# Altium project BLDC_MOTOR_Driver_stm32f446re.PrjPcb (part 2 of 2)

## Sheet ADC_Input_protection.SchDoc
size A4; SheetNumber: 9; SheetTotal: 10
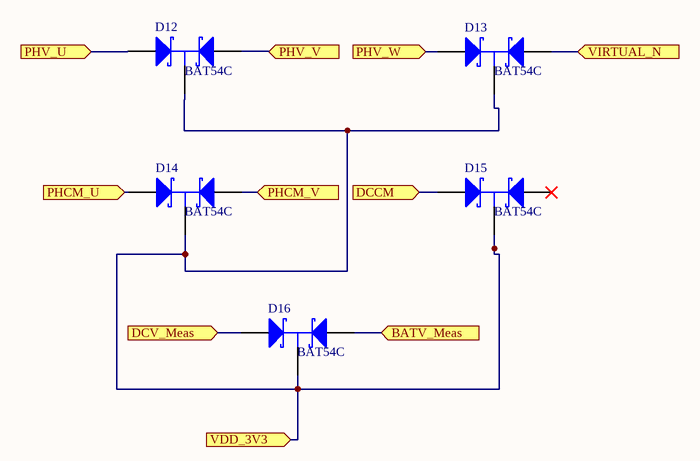
[diagram p5: ADC_Input_protection.SchDoc]

### Parts
D12  BAT54C  [NXP-SOT23-3_V]
D13  BAT54C  [NXP-SOT23-3_V]
D14  BAT54C  [NXP-SOT23-3_V]
D15  BAT54C  [NXP-SOT23-3_V]
D16  BAT54C  [NXP-SOT23-3_V]

### Ports
BATV_Meas (in, see DC_Current_Voltage_Measurement[2C], MCU[3C]), DCCM (in, see DC_Current_Voltage_Measurement[3A], MCU[3B]), DCV_Meas (in, see DC_Current_Voltage_Measurement[3D], MCU[3C]), PHCM_U (in, see MCU[3B], MotorDrivers[1C]), PHCM_V (in, see MCU[3B], MotorDrivers[1C]), PHV_U (in, see MCU[3C], PhaseVoltage[1A], ZeroCrossing[2B]), PHV_V (in, see MCU[3B], PhaseVoltage[1A], ZeroCrossing[2B]), PHV_W (in, see MCU[3C], PhaseVoltage[2A], ZeroCrossing[2C]), VDD_3V3 (in, see DC-DC_Buck_Converter+12Vto+3.3V[3C], DC_Current_Voltage_Measurement[3B], MCU[1B], MotorDrivers[1A], MotorDrivers[1B], Power[2C], ZeroCrossing[1A]), VIRTUAL_N (in, see MCU[3C], PhaseVoltage[1A], ZeroCrossing[1B])

### Nets
R_SHUNT1_N: D13.1(A) ; port VIRTUAL_N
NetC11_1: D12.3(K) D13.3(K) D14.3(K) D15.3(K) D16.3(K) ; port VDD_3V3
NetC41_1: D14.2(A) ; port PHCM_U
NetC42_1: D14.1(A) ; port PHCM_V
NetC45_2: D12.2(A) ; port PHV_U
NetC47_2: D12.1(A) ; port PHV_V
NetC49_2: D13.2(A) ; port PHV_W
NetC51_2: D15.2(A) ; port DCCM
NetC53_2: D16.1(A) ; port BATV_Meas
NetC54_2: D16.2(A) ; port DCV_Meas

Not connected (* = marked no-connect by the designer): D15 1(A)*

### Library data of the parts
D12-D16 = CMP-0417-00003-1: Schottky Barrier Diode, 30 V, 2 uA, -55 to 150 degC, 3-Pin SOT23, RoHS, Tape and Reel; Manufacturer: NXP Semiconductors; IR (uA): 2; VF (mV): 800; Trr (ns): 5; Cd (pF): 10; VR (V): 30; Rth(j-a) (K/W): 500; RoHS: TRUE; Packing: Tape and Reel; ComponentLink2URL: http://www.nxp.com/documents/data_sheet/BAT54_SER.pdf; PartNumber: BAT54C; ComponentLink2Description: Datasheet; Temperature Range: -55 to 150 degC; PackageReference: SOT23-3; PackageDescription: 3-Pin Plastic Surface-mounted Package, Body 1.3 x 2.9 mm, Pitch 0.95 mm; Mounting Technology: Surface Mount; ComponentLink1URL: http://www.nxp.com/; DatasheetVersion: Rev. 5; ComponentLink1Description: Manufacturer URL

## Sheet MotorDrivers.SchDoc
size A4; SheetNumber: 5; SheetTotal: 10
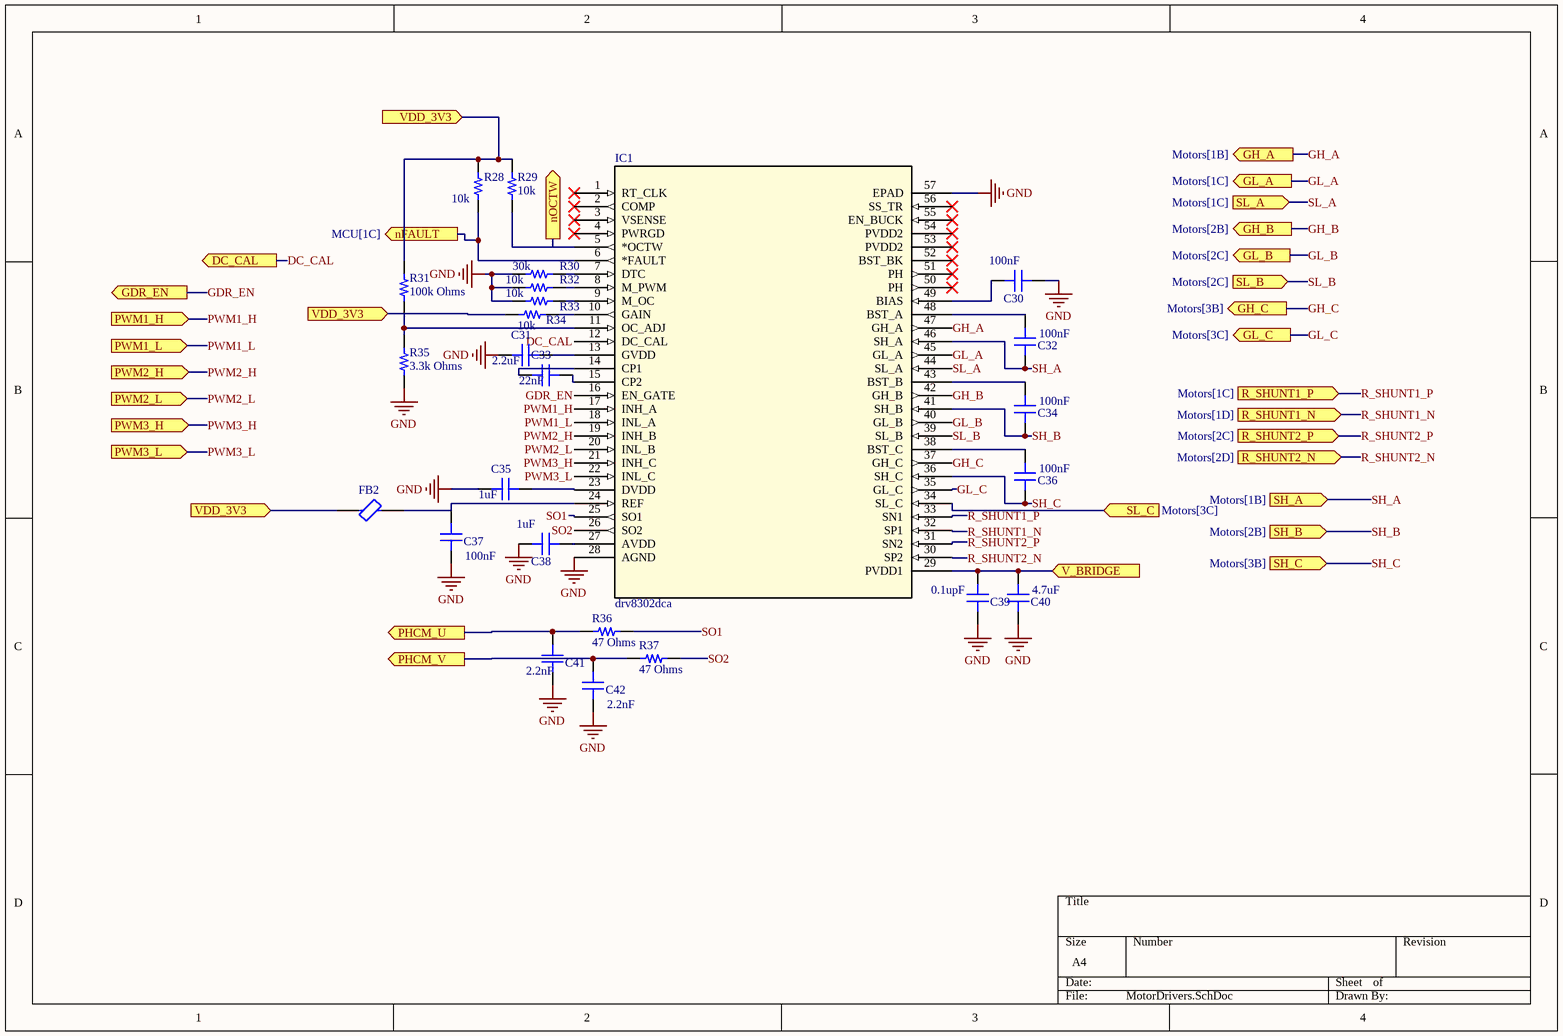
[diagram p6: MotorDrivers.SchDoc]

### Parts
C30  100nF  [CAP 0603_1608]
C31  2.2uF  [CAP 0603_1608]
C32  100nF  [CAP 0603_1608]
C33  22nF  [CAP 0603_1608]
C34  100nF  [CAP 0603_1608]
C35  1uF  [CAP 0603_1608]
C36  100nF  [CAP 0603_1608]
C37  100nF  [CAP 0603_1608]
C38  1uF  [CAP 0603_1608]
C39  0.1upF  [CAP 0603_1608]
C40  4.7uF  [CAP 0603_1608]
C41  2.2nF  [CAP 0603_1608]
C42  2.2nF  [CAP 0603_1608]
FB2  MPZ2012S601AT000  [FP-MPZ2012-MFG]  (value not drawn)
IC1  drv8302dca  [drv8302dca]
R28  10k  [RES 0402_1005]
R29  10k  [RES 0402_1005]
R30  30k  [RES 0402_1005]
R31  100k Ohms  [RES 0402_1005]
R32  10k  [RES 0402_1005]
R33  10k  [RES 0402_1005]
R34  10k  [RES 0402_1005]
R35  3.3k Ohms  [RES 0402_1005]
R36  47 Ohms  [RES 0402_1005]
R37  47 Ohms  [RES 0402_1005]

### Ports
DC_CAL (out, see MCU[3B]), GDR_EN (out, see MCU[3B], Power[2D]), GH_A (out, see Motors[1B]), GH_B (out, see Motors[2B]), GH_C (out, see Motors[3B]), GL_A (out, see Motors[1C]), GL_B (out, see Motors[2C]), GL_C (out, see Motors[3C]), nFAULT (out, see MCU[1C]), nOCTW (out, see MCU[1C]), PHCM_U (out, see ADC_Input_protection[2B], MCU[3B]), PHCM_V (out, see ADC_Input_protection[3B], MCU[3B]), PWM1_H (in, see MCU[3B]), PWM1_L (in, see MCU[3C]), PWM2_H (in, see MCU[3B]), PWM2_L (in, see MCU[3C]), PWM3_H (in, see MCU[3B]), PWM3_L (in, see MCU[3D]), R_SHUNT1_N (in, see Motors[1D]), R_SHUNT1_P (in, see Motors[1C]), R_SHUNT2_N (in, see Motors[2D]), R_SHUNT2_P (in, see Motors[2C]), SH_A (in, see Motors[1B]), SH_B (in, see Motors[2B]), SH_C (in, see Motors[3B]), SL_A (in, see Motors[1C]), SL_B (in, see Motors[2C]), SL_C (in, see Motors[3C]), V_BRIDGE (in, see DC-DC_Buck_Converter+12Vto+3.3V[1A], DC_Current_Voltage_Measurement[3B], Motors[1A], Power[4A]), VDD_3V3 (in, see ADC_Input_protection[3C], DC-DC_Buck_Converter+12Vto+3.3V[3C], DC_Current_Voltage_Measurement[3B], MCU[1B], MotorDrivers[1A], MotorDrivers[1B], Power[2C], ZeroCrossing[1A]), VDD_3V3 (in, see ADC_Input_protection[3C], DC-DC_Buck_Converter+12Vto+3.3V[3C], DC_Current_Voltage_Measurement[3B], MCU[1B], MotorDrivers[1B], Power[2C], ZeroCrossing[1A])

### Nets
R_SHUNT1_N: C30.2 C31.1 C35.1 C37.2 C38.2 C39.1 C40.1 C41.2 C42.2 IC1.28(AGND) IC1.30(SP2) IC1.32(SP1) IC1.34(SL_C) IC1.57(EPAD) R30.1 R32.1 R33.1 R35.2 ; port SL_C, port R_SHUNT1_N, port R_SHUNT2_N  [also labelled GND, R_SHUNT2_N]
DC_CAL: IC1.12(DC_CAL) ; port DC_CAL
GDR_EN: IC1.16(EN_GATE) ; port GDR_EN
GH_A: IC1.47(GH_A) ; port GH_A
GH_B: IC1.42(GH_B) ; port GH_B
GH_C: IC1.37(GH_C) ; port GH_C
GL_A: IC1.45(GL_A) ; port GL_A
GL_B: IC1.40(GL_B) ; port GL_B
GL_C: IC1.35(GL_C) ; port GL_C
PWM1_H: IC1.17(INH_A) ; port PWM1_H
PWM1_L: IC1.18(INL_A) ; port PWM1_L
PWM2_H: IC1.19(INH_B) ; port PWM2_H
PWM2_L: IC1.20(INL_B) ; port PWM2_L
PWM3_H: IC1.21(INH_C) ; port PWM3_H
PWM3_L: IC1.22(INL_C) ; port PWM3_L
R_SHUNT1_P: IC1.33(SN1) IC1.44(SL_A) ; port SL_A, port R_SHUNT1_P  [also labelled SL_A]
R_SHUNT2_P: IC1.31(SN2) IC1.39(SL_B) ; port SL_B, port R_SHUNT2_P  [also labelled SL_B]
SH_A: C32.1 IC1.46(SH_A) ; port SH_A  [project net MOTOR_U]
SH_B: C34.1 IC1.41(SH_B) ; port SH_B  [project net MOTOR_V]
SH_C: C36.1 IC1.36(SH_C) ; port SH_C  [project net MOTOR_W]
SO1: IC1.25(SO1) R36.2
SO2: IC1.26(SO2) R37.2
NetC2_1: C39.2 C40.2 IC1.29(PVDD1) ; port V_BRIDGE
NetC11_1: FB2.1 R28.1 R29.1 R31.1 R34.1 ; port VDD_3V3
NetC30_1: C30.1 IC1.49(BIAS)
NetC31_2: C31.2 IC1.13(GVDD)
NetC32_2: C32.2 IC1.48(BST_A)
NetC33_1: C33.1 IC1.14(CP1)
NetC33_2: C33.2 IC1.15(CP2)
NetC34_2: C34.2 IC1.43(BST_B)
NetC35_2: C35.2 IC1.23(DVDD)
NetC36_2: C36.2 IC1.38(BST_C)
NetC37_1: C37.1 FB2.2 IC1.24(REF)
NetC38_1: C38.1 IC1.27(AVDD)
NetC41_1: C41.1 R36.1 ; port PHCM_U
NetC42_1: C42.1 R37.1 ; port PHCM_V
NetIC1_5: IC1.5(*OCTW) R29.2 ; port nOCTW
NetIC1_6: IC1.6(*FAULT) R28.2 ; port nFAULT
NetIC1_7: IC1.7(DTC) R30.2
NetIC1_8: IC1.8(M_PWM) R32.2
NetIC1_9: IC1.9(M_OC) R33.2
NetIC1_10: IC1.10(GAIN) R34.2
NetIC1_11: IC1.11(OC_ADJ) R31.2 R35.1

Not connected (* = marked no-connect by the designer): IC1 1(RT_CLK)* 2(COMP)* 3(VSENSE)* 4(PWRGD)* 50(PH)* 51(PH)* 52(BST_BK)* 53(PVDD2)* 54(PVDD2)* 55(EN_BUCK)* 56(SS_TR)*

### Library data of the parts
C30 C32 C34 C36-C38 C40-C42 = 0603ZC102KAT2A: CAP CER 1000PF 10V X7R 0603; manufacturer: AVX Corporation; Tolerance: ±10%; Part Number: 0603ZC102KAT2A; Applications: General Purpose; componentlink1description: Datasheet; componentlink1url: http://datasheets.avx.com/X7RDielectric.pdf; componentlink2description: DigiKey Link; componentlink2url: http://digikey.com/product-detail/en/avx-corporation/0603ZC102KAT2A/478-0603ZC102KAT2ACT-ND/11570315; Device Package: 0603 (1608 Metric); lastupdated: 2.09.2020 01:02:55; Lifecycle Status: Active; Minimum Order: 1; Mounting Type: Surface Mount, MLCC; Operating Temperature: -55°C ~ 125°C; Package / Case: 0603 (1608 Metric); packaging: TapeAndReel; partid: 27370; Part Status: Active; price: 0.01; series: -; Supplier 1: DigiKey; Supplier Part Number 1: 478-0603ZC102KAT2ACT-ND; Temperature Coefficient: X7R; Voltage - Rated: 10V
  C30 C32 C34 C36 C37: Value: 100nF; Capacitance: 100nF
  C38: Value: 1uF; Capacitance: 1uF
  C40: Value: 4.7uF; Capacitance: 4.7uF
  C41 C42: Value: 2.2nF; Capacitance: 2.2nF
C31 C33 C35 = 0603ZC102KAT2A: CAP CER 1000PF 10V X7R 0603; manufacturer: AVX Corporation; Capacitance: 2.2nF; Tolerance: ±10%; Part Number: 0603ZC102KAT2A; Applications: General Purpose; componentlink1description: Datasheet; componentlink1url: http://datasheets.avx.com/X7RDielectric.pdf; componentlink2description: DigiKey Link; componentlink2url: http://digikey.com/product-detail/en/avx-corporation/0603ZC102KAT2A/478-0603ZC102KAT2ACT-ND/11570315; Device Package: 0603 (1608 Metric); lastupdated: 2.09.2020 01:02:55; Lifecycle Status: Active; Minimum Order: 1; Mounting Type: Surface Mount, MLCC; Operating Temperature: -55°C ~ 125°C; Package / Case: 0603 (1608 Metric); packaging: TapeAndReel; partid: 27370; Part Status: Active; price: 0.01; series: -; Supplier 1: DigiKey; Supplier Part Number 1: 478-0603ZC102KAT2ACT-ND; Temperature Coefficient: X7R; Voltage - Rated: 10V
  C31: Value: 2.2uF
  C33: Value: 22nF
  C35: Value: 1uF
C39 = 0603ZC102KAT2A: CAP CER 1000PF 10V X7R 0603; manufacturer: AVX Corporation; Capacitance: 0.1uF; Tolerance: ±10%; Part Number: 0603ZC102KAT2A; Value: 0.1upF; Applications: General Purpose; componentlink1description: Datasheet; componentlink1url: http://datasheets.avx.com/X7RDielectric.pdf; componentlink2description: DigiKey Link; componentlink2url: http://digikey.com/product-detail/en/avx-corporation/0603ZC102KAT2A/478-0603ZC102KAT2ACT-ND/11570315; Device Package: 0603 (1608 Metric); lastupdated: 2.09.2020 01:02:55; Lifecycle Status: Active; Minimum Order: 1; Mounting Type: Surface Mount, MLCC; Operating Temperature: -55°C ~ 125°C; Package / Case: 0603 (1608 Metric); packaging: TapeAndReel; partid: 27370; Part Status: Active; price: 0.01; series: -; Supplier 1: DigiKey; Supplier Part Number 1: 478-0603ZC102KAT2ACT-ND; Temperature Coefficient: X7R; Voltage - Rated: 10V
FB2 = CMP-2000-05401-2: Manufacturer Lifecycle Status: PRODUCTION; NexarPartId: 12090955; RMS Current (Irms): 2A; Test Frequency: 100MHz; Tolerance: 25%; Core Material: Ferrite; Series Resistance: 100mΩ; Impedance: 600Ω; Packaging: Digi-Reel®; Length: 2mm; Min Operating Temperature: -55°C; Width: 1.25mm; Max Width: 1.45mm; Lead Free: Lead Free; Current Rating: 2A; Case Code (Imperial): 0805; Min Length: 1.8mm; Schedule B: 8504500000, 8504500000; REACH SVHC: No SVHC; Case Code (Metric): 2012; Max DC Current: 2A; Case/Package: 0805; Lifecycle Status: Production; Min Width: 1.05mm; Mount: Surface Mount; Height: 1.0414mm; Resistance: 100mΩ; DC Resistance (DCR): 100mΩ; Max Operating Temperature: 125°C; Max Length: 2.2mm; RoHS: Compliant
R28 R29 R32-R34 = ESR01MZPF47R0: ANTI-SURGE CHIP RESISTORS; Manufacturer: Rohm Semiconductor; Power (Watts): 0.2W, 1/5W; Resistance: 10k Ohms; Temperature Coefficient: ±100ppm/°C; Tolerance: ±1%; Part Number: ESR01MZPF47R0; Value: 10k; ComponentLink1Description: Datasheet; ComponentLink1URL: https://fscdn.rohm.com/en/products/databook/datasheet/passive/resistor/chip_resistor/esr-e.pdf; ComponentLink2Description: DigiKey Link; ComponentLink2URL: https://www.digikey.com/en/products/detail/rohm-semiconductor/ESR01MZPF47R0/16180187; Composition: Thick Film; Device Package: 0402 (1005 Metric); Features: Automotive AEC-Q200, Pulse Withstanding; Height - Seated (Max): 0.016" (0.40mm); LastUpdated: 5.10.2023 19:23:22; Lifecycle Status: Active; Minimum Order: 1; Number of Terminations: 2; Operating Temperature: -55°C ~ 155°C; Package / Case: 0402 (1005 Metric); Packaging: TapeAndReel; PartId: 67421; Part Status: Active; Price: 0.03; Ratings: AEC-Q200; Series: ESR; Size / Dimension: 0.039" L x 0.020" W (1.00mm x 0.50mm); Supplier 1: DigiKey; Supplier Part Number 1: 511-ESR01MZPF47R0CT-ND; Supplier Device Package: 0402
R30 = ESR01MZPF47R0: ANTI-SURGE CHIP RESISTORS; Manufacturer: Rohm Semiconductor; Power (Watts): 0.2W, 1/5W; Resistance: 30k Ohms; Temperature Coefficient: ±100ppm/°C; Tolerance: ±1%; Part Number: ESR01MZPF47R0; Value: 30k; ComponentLink1Description: Datasheet; ComponentLink1URL: https://fscdn.rohm.com/en/products/databook/datasheet/passive/resistor/chip_resistor/esr-e.pdf; ComponentLink2Description: DigiKey Link; ComponentLink2URL: https://www.digikey.com/en/products/detail/rohm-semiconductor/ESR01MZPF47R0/16180187; Composition: Thick Film; Device Package: 0402 (1005 Metric); Features: Automotive AEC-Q200, Pulse Withstanding; Height - Seated (Max): 0.016" (0.40mm); LastUpdated: 5.10.2023 19:23:22; Lifecycle Status: Active; Minimum Order: 1; Number of Terminations: 2; Operating Temperature: -55°C ~ 155°C; Package / Case: 0402 (1005 Metric); Packaging: TapeAndReel; PartId: 67421; Part Status: Active; Price: 0.03; Ratings: AEC-Q200; Series: ESR; Size / Dimension: 0.039" L x 0.020" W (1.00mm x 0.50mm); Supplier 1: DigiKey; Supplier Part Number 1: 511-ESR01MZPF47R0CT-ND; Supplier Device Package: 0402
R31 R35 = ESR01MZPF47R0: ANTI-SURGE CHIP RESISTORS; Manufacturer: Rohm Semiconductor; Power (Watts): 0.2W, 1/5W; Resistance: 47 Ohms; Temperature Coefficient: ±100ppm/°C; Tolerance: ±1%; Part Number: ESR01MZPF47R0; ComponentLink1Description: Datasheet; ComponentLink1URL: https://fscdn.rohm.com/en/products/databook/datasheet/passive/resistor/chip_resistor/esr-e.pdf; ComponentLink2Description: DigiKey Link; ComponentLink2URL: https://www.digikey.com/en/products/detail/rohm-semiconductor/ESR01MZPF47R0/16180187; Composition: Thick Film; Device Package: 0402 (1005 Metric); Features: Automotive AEC-Q200, Pulse Withstanding; Height - Seated (Max): 0.016" (0.40mm); LastUpdated: 5.10.2023 19:23:22; Lifecycle Status: Active; Minimum Order: 1; Number of Terminations: 2; Operating Temperature: -55°C ~ 155°C; Package / Case: 0402 (1005 Metric); Packaging: TapeAndReel; PartId: 67421; Part Status: Active; Price: 0.03; Ratings: AEC-Q200; Series: ESR; Size / Dimension: 0.039" L x 0.020" W (1.00mm x 0.50mm); Supplier 1: DigiKey; Supplier Part Number 1: 511-ESR01MZPF47R0CT-ND; Supplier Device Package: 0402
  R31: Value: 100k Ohms
  R35: Value: 3.3k Ohms
R36 R37 = ESR01MZPF47R0: ANTI-SURGE CHIP RESISTORS; Manufacturer: Rohm Semiconductor; Power (Watts): 0.2W, 1/5W; Temperature Coefficient: ±100ppm/°C; Tolerance: ±1%; Part Number: ESR01MZPF47R0; Value: 47 Ohms; ComponentLink1Description: Datasheet; ComponentLink1URL: https://fscdn.rohm.com/en/products/databook/datasheet/passive/resistor/chip_resistor/esr-e.pdf; ComponentLink2Description: DigiKey Link; ComponentLink2URL: https://www.digikey.com/en/products/detail/rohm-semiconductor/ESR01MZPF47R0/16180187; Composition: Thick Film; Device Package: 0402 (1005 Metric); Features: Automotive AEC-Q200, Pulse Withstanding; Height - Seated (Max): 0.016" (0.40mm); LastUpdated: 5.10.2023 19:23:22; Lifecycle Status: Active; Minimum Order: 1; Number of Terminations: 2; Operating Temperature: -55°C ~ 155°C; Package / Case: 0402 (1005 Metric); Packaging: TapeAndReel; PartId: 67421; Part Status: Active; Price: 0.03; Ratings: AEC-Q200; Resistance: 47 Ohms; Series: ESR; Size / Dimension: 0.039" L x 0.020" W (1.00mm x 0.50mm); Supplier 1: DigiKey; Supplier Part Number 1: 511-ESR01MZPF47R0CT-ND; Supplier Device Package: 0402

## Sheet ZeroCrossing.SchDoc
size A4; SheetNumber: 7; SheetTotal: 10
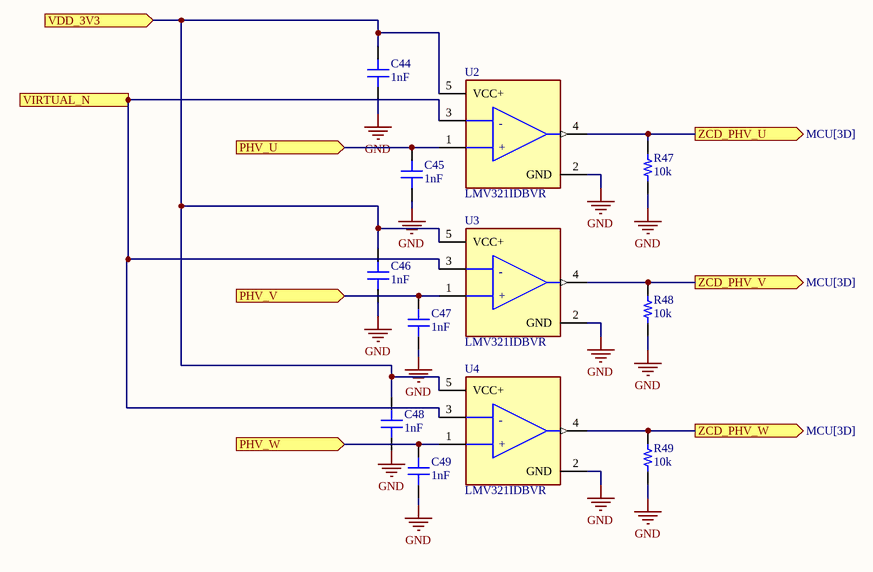
[diagram p7: ZeroCrossing.SchDoc]

### Parts
C44  1nF  [CAP 0603_1608]
C45  1nF  [CAP 0603_1608]
C46  1nF  [CAP 0603_1608]
C47  1nF  [CAP 0603_1608]
C48  1nF  [CAP 0603_1608]
C49  1nF  [CAP 0603_1608]
R47  10k  [RES 0402_1005]
R48  10k  [RES 0402_1005]
R49  10k  [RES 0402_1005]
U2  LMV321IDBVR  [FP-DBV0005A-MFG]
U3  LMV321IDBVR  [FP-DBV0005A-MFG]
U4  LMV321IDBVR  [FP-DBV0005A-MFG]

### Ports
PHV_U (in, see ADC_Input_protection[2B], MCU[3C], PhaseVoltage[1A]), PHV_V (in, see ADC_Input_protection[3B], MCU[3B], PhaseVoltage[1A]), PHV_W (in, see ADC_Input_protection[3B], MCU[3C], PhaseVoltage[2A]), VDD_3V3 (in, see ADC_Input_protection[3C], DC-DC_Buck_Converter+12Vto+3.3V[3C], DC_Current_Voltage_Measurement[3B], MCU[1B], MotorDrivers[1A], MotorDrivers[1B], Power[2D]), VIRTUAL_N (in, see ADC_Input_protection[4B], MCU[3C]), ZCD_PHV_U (out, see MCU[3D]), ZCD_PHV_V (out, see MCU[3D]), ZCD_PHV_W (out, see MCU[3D])

### Nets
GND: C44.1 C45.1 C46.1 C47.1 C48.1 C49.1 R47.1 R48.1 R49.1 U2.2(GND) U2.3(1IN-) U3.2(GND) U3.3(1IN-) U4.2(GND) U4.3(1IN-) ; port VIRTUAL_N  [project net R_SHUNT1_N]
NetC11_1: C44.2 C46.2 C48.2 U2.5(VCC+) U3.5(VCC+) U4.5(VCC+) ; port VDD_3V3
NetC45_2: C45.2 U2.1(1IN+) ; port PHV_U
NetC47_2: C47.2 U3.1(1IN+) ; port PHV_V
NetC49_2: C49.2 U4.1(1IN+) ; port PHV_W
NetIC2_24: R47.2 U2.4(OUT) ; port ZCD_PHV_U
NetIC2_37: R48.2 U3.4(OUT) ; port ZCD_PHV_V
NetIC2_51: R49.2 U4.4(OUT) ; port ZCD_PHV_W

### Notes on the sheet
- (in symbol CMP-04895-000056-1) -; +

### Library data of the parts
C44-C49 = 0603ZC102KAT2A: as C30 on sheet MotorDrivers; Part Number: 0603ZC102KAT2A; Value: 1nF; Applications: General Purpose; Capacitance: 1nF; componentlink1description: Datasheet; componentlink1url: http://datasheets.avx.com/X7RDielectric.pdf; componentlink2description: DigiKey Link; componentlink2url: http://digikey.com/product-detail/en/avx-corporation/0603ZC102KAT2A/478-0603ZC102KAT2ACT-ND/11570315; Device Package: 0603 (1608 Metric); lastupdated: 2.09.2020 01:02:55; Lifecycle Status: Active; Minimum Order: 1; Mounting Type: Surface Mount, MLCC; Operating Temperature: -55°C ~ 125°C; Package / Case: 0603 (1608 Metric); packaging: TapeAndReel; partid: 27370; Part Status: Active; price: 0.01; series: -; Supplier 1: DigiKey; Supplier Part Number 1: 478-0603ZC102KAT2ACT-ND; Temperature Coefficient: X7R; Voltage - Rated: 10V
R47-R49 = ESR01MZPF47R0: as R28 on sheet MotorDrivers; Part Number: ESR01MZPF47R0; Value: 10k; ComponentLink1Description: Datasheet; ComponentLink1URL: https://fscdn.rohm.com/en/products/databook/datasheet/passive/resistor/chip_resistor/esr-e.pdf; ComponentLink2Description: DigiKey Link; ComponentLink2URL: https://www.digikey.com/en/products/detail/rohm-semiconductor/ESR01MZPF47R0/16180187; Composition: Thick Film; Device Package: 0402 (1005 Metric); Features: Automotive AEC-Q200, Pulse Withstanding; Height - Seated (Max): 0.016" (0.40mm); LastUpdated: 5.10.2023 19:23:22; Lifecycle Status: Active; Minimum Order: 1; Number of Terminations: 2; Operating Temperature: -55°C ~ 155°C; Package / Case: 0402 (1005 Metric); Packaging: TapeAndReel; PartId: 67421; Part Status: Active; Price: 0.03; Ratings: AEC-Q200; Series: ESR; Size / Dimension: 0.039" L x 0.020" W (1.00mm x 0.50mm); Supplier 1: DigiKey; Supplier Part Number 1: 511-ESR01MZPF47R0CT-ND; Supplier Device Package: 0402
U2-U4 = CMP-04895-000056-1: IC OPAMP GP 1 CIRCUIT SOT23-5; Manufacturer: Texas Instruments; Bandwidth: 1MHz; Number Of Channels: 1; Max Junction Temp: +150°C; Input Offset Voltage: 1.7mV; Standoff Height: 0mm; Voltage Gain: 100V/mV; Min Supply Voltage: 2.7V; Input Bias Current: 0.015uA; Nominal Supply Current: 80-130uA; Max Supply Voltage: 5.5V; Ambient Temperature Range Low: -40°C; Device Class L3: Amplifiers - Op Amps; Package: DBV0005A; Temperature: -40°C to +125°C; Automotive: No; Ambient Temperature Range High: +125°C; ComponentLink2Description: Datasheet; Manufacturer Part Number: LMV321IDBVR; Octopart: https://octopart.com/lmv321idbvr-texas+instruments-410381; ComponentLink2URL: http://www.ti.com/lit/ds/symlink/lmv321.pdf; Temperature Range High: +125°C; Device Class L1: Integrated Circuits (ICs); Temperature Range Low: -40°C; Digikey Description: IC OPAMP GP 1 CIRCUIT SOT23-5; RoHS: TRUE; Height: 1.45mm; Mouser Description: Operational Amplifiers - Op Amps Low V R/R; Device Class L2: Linear ICs; Gain Bandwidth: 1MHz; Lead Free: Yes; Category: IC

## Sheet DC_Current_Voltage_Measurement.SchDoc
size A4; SheetNumber: 8; SheetTotal: 10
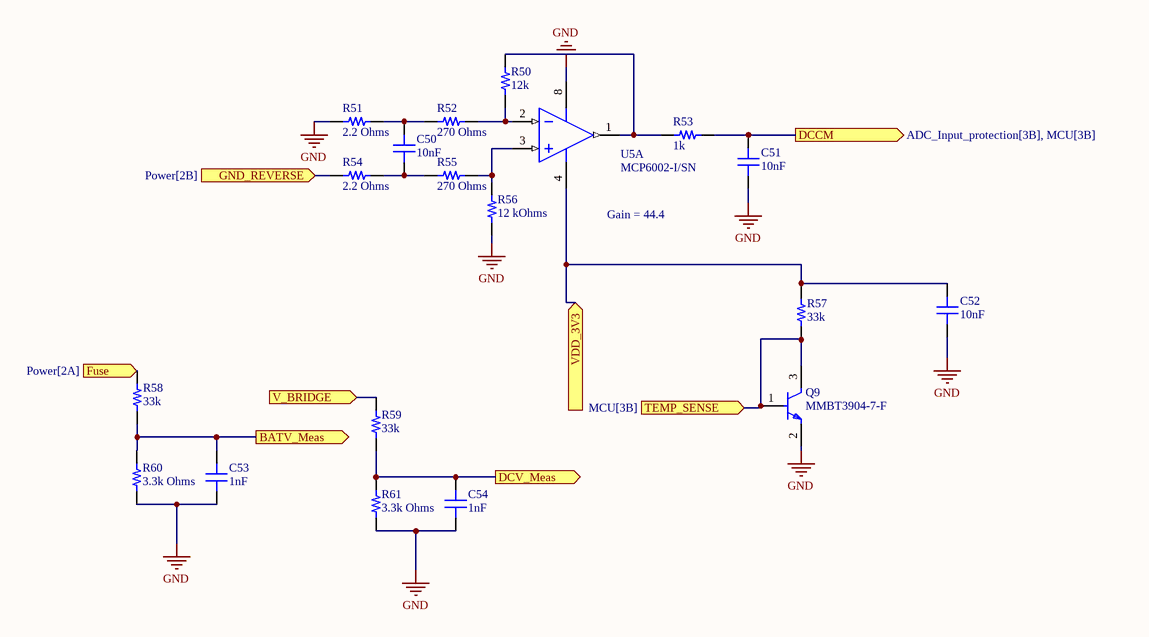
[diagram p8: DC_Current_Voltage_Measurement.SchDoc]

### Parts
C50  10nF  [CAP 0603_1608]
C51  10nF  [CAP 0603_1608]
C52  10nF  [CAP 0603_1608]
C53  1nF  [CAP 0603_1608]
C54  1nF  [CAP 0603_1608]
Q9  MMBT3904-7-F  [FP-SOT23-IPC_A]
R50  12k  [RES 0402_1005]
R51  2.2 Ohms  [RES 0402_1005]
R52  270 Ohms  [RES 0402_1005]
R53  1k  [RES 0402_1005]
R54  2.2 Ohms  [RES 0402_1005]
R55  270 Ohms  [RES 0402_1005]
R56  12 kOhms  [RES 0402_1005]
R57  33k  [RES 0402_1005]
R58  33k  [RES 0402_1005]
R59  33k  [RES 0402_1005]
R60  3.3k Ohms  [RES 0402_1005]
R61  3.3k Ohms  [RES 0402_1005]
U5  MCP6002-I/SN  [SOIC-SN8_M]  (part A of 2)

### Ports
BATV_Meas (out, see ADC_Input_protection[3C], MCU[3C]), DCCM (out, see ADC_Input_protection[3B], MCU[3B]), DCV_Meas (out, see ADC_Input_protection[2C], MCU[3C]), Fuse (in, see Power[2A]), GND_REVERSE (in, see Power[2B]), TEMP_SENSE (in, see MCU[3B]), V_BRIDGE (in, see DC-DC_Buck_Converter+12Vto+3.3V[1A], MotorDrivers[3C], Motors[1A], Power[4A]), VDD_3V3 (in, see ADC_Input_protection[3C], DC-DC_Buck_Converter+12Vto+3.3V[3C], MCU[1B], MotorDrivers[1A], MotorDrivers[1B], Power[2C], ZeroCrossing[1A])

### Nets
GND: C51.1 C52.1 C53.1 C54.1 Q9.2(E) R51.1 R54.1 R56.1 R60.1 R61.1 U5.8(VDD) ; port GND_REVERSE  [project net R_SHUNT1_N]
NetC1_1: R58.2 ; port Fuse
NetC2_1: R59.2 ; port V_BRIDGE
NetC11_1: C52.2 R57.2 U5.4(VSS) ; port VDD_3V3
NetC50_1: C50.1 R54.2 R55.1
NetC50_2: C50.2 R51.2 R52.1
NetC51_2: C51.2 R53.2 ; port DCCM
NetC53_2: C53.2 R58.1 R60.2 ; port BATV_Meas
NetC54_2: C54.2 R59.1 R61.2 ; port DCV_Meas
NetIC2_22: Q9.1(B) Q9.3(C) R57.1 ; port TEMP_SENSE
NetR50_1: R50.1 R52.2 U5.2(VINA-)
NetR50_2: R50.2 R53.1 U5.1(VOUTA)
NetR55_2: R55.2 R56.2 U5.3(VINA+)

### Notes on the sheet
- Gain = 44.4

### Library data of the parts
C50-C54 = 0603ZC102KAT2A: as C30 on sheet MotorDrivers; Part Number: 0603ZC102KAT2A; Applications: General Purpose; componentlink1description: Datasheet; componentlink1url: http://datasheets.avx.com/X7RDielectric.pdf; componentlink2description: DigiKey Link; componentlink2url: http://digikey.com/product-detail/en/avx-corporation/0603ZC102KAT2A/478-0603ZC102KAT2ACT-ND/11570315; Device Package: 0603 (1608 Metric); lastupdated: 2.09.2020 01:02:55; Lifecycle Status: Active; Minimum Order: 1; Mounting Type: Surface Mount, MLCC; Operating Temperature: -55°C ~ 125°C; Package / Case: 0603 (1608 Metric); packaging: TapeAndReel; partid: 27370; Part Status: Active; price: 0.01; series: -; Supplier 1: DigiKey; Supplier Part Number 1: 478-0603ZC102KAT2ACT-ND; Temperature Coefficient: X7R; Voltage - Rated: 10V
  C50-C52: Value: 10nF; Capacitance: 10nF
  C53 C54: Value: 1nF; Capacitance: 1nF
Q9 = CMP-2000-04931-2: TRANS NPN 40V 0.2A SMD SOT23-3; Frequency: 300MHz; Power Dissipation: 350mW; Element Configuration: Single; Max Power Dissipation: 300mW; Max Collector Current: 200mA; Collector Emitter Saturation Voltage: 300mV; Number of Elements: 1; hFE Min: 100; Collector Base Voltage (VCBO): 60V; Emitter Base Voltage (VEBO): 6V; Contact Plating: Tin; Package Quantity: 3000; Max Frequency: 300MHz; REACH SVHC: No SVHC; Max Operating Temperature: 150°C; Width: 1.4mm; Collector Emitter Voltage (VCEO): 40V; Voltage Rating (DC): 40V; Radiation Hardening: No; Case/Package: SOT-23; Height: 1mm; Collector Emitter Breakdown Voltage: 40V; Length: 3.05mm; Polarity: NPN; Packaging: Tape and Reel; Number of Pins: 3; Min Operating Temperature: -55°C; Gain Bandwidth Product: 300MHz; Mount: Surface Mount; Weight: 0.000282oz; Continuous Collector Current: 200mA; Transition Frequency: 300MHz; Max Breakdown Voltage: 40V; Lead Free: Lead Free
R50 = ESR01MZPF47R0: ANTI-SURGE CHIP RESISTORS; Manufacturer: Rohm Semiconductor; Power (Watts): 0.2W, 1/5W; Resistance: 12k Ohms; Temperature Coefficient: ±100ppm/°C; Tolerance: ±1%; Part Number: ESR01MZPF47R0; Value: 12k; ComponentLink1Description: Datasheet; ComponentLink1URL: https://fscdn.rohm.com/en/products/databook/datasheet/passive/resistor/chip_resistor/esr-e.pdf; ComponentLink2Description: DigiKey Link; ComponentLink2URL: https://www.digikey.com/en/products/detail/rohm-semiconductor/ESR01MZPF47R0/16180187; Composition: Thick Film; Device Package: 0402 (1005 Metric); Features: Automotive AEC-Q200, Pulse Withstanding; Height - Seated (Max): 0.016" (0.40mm); LastUpdated: 5.10.2023 19:23:22; Lifecycle Status: Active; Minimum Order: 1; Number of Terminations: 2; Operating Temperature: -55°C ~ 155°C; Package / Case: 0402 (1005 Metric); Packaging: TapeAndReel; PartId: 67421; Part Status: Active; Price: 0.03; Ratings: AEC-Q200; Series: ESR; Size / Dimension: 0.039" L x 0.020" W (1.00mm x 0.50mm); Supplier 1: DigiKey; Supplier Part Number 1: 511-ESR01MZPF47R0CT-ND; Supplier Device Package: 0402
R51 R54 R60 R61 = SG73P1EWTTP2R20F: RES 2.2 OHM 1% 1/4W 0402; Manufacturer: KOA Speer Electronics, Inc.; Power (Watts): 0.25W, 1/4W; Temperature Coefficient: ±200ppm/°C; Part Number: SG73P1EWTTP2R20F; ComponentLink1Description: Datasheet; ComponentLink1URL: https://www.koaspeer.com/pdfs/SG73P.pdf; ComponentLink2Description: DigiKey Link; ComponentLink2URL: https://www.digikey.com/en/products/detail/koa-speer-electronics-inc/SG73P1EWTTP2R20F/14316750; Composition: Thick Film; Device Package: 0402 (1005 Metric); Features: Automotive AEC-Q200, Pulse Withstanding; Height - Seated (Max): 0.016" (0.40mm); LastUpdated: 5.10.2023 19:23:22; Lifecycle Status: Active; Minimum Order: 1; Number of Terminations: 2; Operating Temperature: -55°C ~ 155°C; Package / Case: 0402 (1005 Metric); Packaging: TapeAndReel; PartId: 67136; Part Status: Active; Price: 0.01; Ratings: AEC-Q200; Series: SG73P; Size / Dimension: 0.039" L x 0.020" W (1.00mm x 0.50mm); Supplier 1: DigiKey; Supplier Part Number 1: 2019-SG73P1EWTTP2R20FCT-ND; Supplier Device Package: 0402; Tolerance: ±1%
  R51 R54: Value: 2.2 Ohms; Resistance: 2.2 Ohms
  R60 R61: Value: 3.3k Ohms; Resistance: 3.3k Ohms
R52 R55 = RK73H1ETTP2R70F: RES 2.7 OHM 1% 1/10W 0402; Manufacturer: KOA Speer Electronics, Inc.; Power (Watts): 0.1W, 1/10W; Temperature Coefficient: ±200ppm/°C; Part Number: RK73H1ETTP2R70F; Value: 270 Ohms; ComponentLink1Description: Datasheet; ComponentLink1URL: http://www.koaspeer.com/catimages/Products/RK73H/RK73H.pdf; ComponentLink2Description: DigiKey Link; ComponentLink2URL: https://www.digikey.com/en/products/detail/koa-speer-electronics-inc/RK73H1ETTP2R70F/9844612; Composition: Thick Film; Device Package: 0402 (1005 Metric); Features: Automotive AEC-Q200, Moisture Resistant; Height - Seated (Max): 0.016" (0.40mm); LastUpdated: 5.10.2023 19:24:09; Lifecycle Status: Active; Minimum Order: 1; Number of Terminations: 2; Operating Temperature: -55°C ~ 155°C; Package / Case: 0402 (1005 Metric); Packaging: CutTape; PartId: 14375; Part Status: Active; Price: 0.01; Ratings: AEC-Q200; Resistance: 270 Ohms; Series: RK73H; Size / Dimension: 0.039" L x 0.020" W (1.00mm x 0.50mm); Supplier 1: DigiKey; Supplier Part Number 1: 2019-RK73H1ETTP2R70FCT-ND; Supplier Device Package: 0402; Tolerance: ±1%
R53 = ESR01MZPF47R0: ANTI-SURGE CHIP RESISTORS; Manufacturer: Rohm Semiconductor; Power (Watts): 0.2W, 1/5W; Resistance: 1k Ohms; Temperature Coefficient: ±100ppm/°C; Tolerance: ±1%; Part Number: ESR01MZPF47R0; Value: 1k; ComponentLink1Description: Datasheet; ComponentLink1URL: https://fscdn.rohm.com/en/products/databook/datasheet/passive/resistor/chip_resistor/esr-e.pdf; ComponentLink2Description: DigiKey Link; ComponentLink2URL: https://www.digikey.com/en/products/detail/rohm-semiconductor/ESR01MZPF47R0/16180187; Composition: Thick Film; Device Package: 0402 (1005 Metric); Features: Automotive AEC-Q200, Pulse Withstanding; Height - Seated (Max): 0.016" (0.40mm); LastUpdated: 5.10.2023 19:23:22; Lifecycle Status: Active; Minimum Order: 1; Number of Terminations: 2; Operating Temperature: -55°C ~ 155°C; Package / Case: 0402 (1005 Metric); Packaging: TapeAndReel; PartId: 67421; Part Status: Active; Price: 0.03; Ratings: AEC-Q200; Series: ESR; Size / Dimension: 0.039" L x 0.020" W (1.00mm x 0.50mm); Supplier 1: DigiKey; Supplier Part Number 1: 511-ESR01MZPF47R0CT-ND; Supplier Device Package: 0402
R56 = CRGP0402F12K: RES 12K OHM 1% 1/8W 0402; Manufacturer: TE Connectivity Passive Product; Power (Watts): 0.125W, 1/8W; Temperature Coefficient: ±100ppm/°C; Part Number: CRGP0402F12K; Value: 12 kOhms; ComponentLink1Description: Datasheet; ComponentLink1URL: https://www.te.com/commerce/DocumentDelivery/DDEController?Action=srchrtrv&DocNm=9-1773463-9&DocType=DS&DocLang=English; ComponentLink2Description: DigiKey Link; ComponentLink2URL: https://www.digikey.com/en/products/detail/te-connectivity-passive-product/CRGP0402F12K/8576970; Composition: Thick Film; Device Package: 0402 (1005 Metric); Features: Pulse Withstanding; Height - Seated (Max): 0.016" (0.40mm); LastUpdated: 5.10.2023 19:23:42; Lifecycle Status: Active; Minimum Order: 1; Number of Terminations: 2; Operating Temperature: -55°C ~ 155°C; Package / Case: 0402 (1005 Metric); Packaging: TapeAndReel; PartId: 21536; Part Status: Active; Price: 0.01; Resistance: 12 kOhms; Series: CRGP; Size / Dimension: 0.043" L x 0.020" W (1.10mm x 0.50mm); Supplier 1: DigiKey; Supplier Part Number 1: A130368CT-ND; Supplier Device Package: 0402; Tolerance: ±1%
R57-R59 = SG73P1EWTTP2R20F: RES 2.2 OHM 1% 1/4W 0402; Manufacturer: KOA Speer Electronics, Inc.; Power (Watts): 0.25W, 1/4W; Resistance: 33k Ohms; Temperature Coefficient: ±200ppm/°C; Part Number: SG73P1EWTTP2R20F; Value: 33k; ComponentLink1Description: Datasheet; ComponentLink1URL: https://www.koaspeer.com/pdfs/SG73P.pdf; ComponentLink2Description: DigiKey Link; ComponentLink2URL: https://www.digikey.com/en/products/detail/koa-speer-electronics-inc/SG73P1EWTTP2R20F/14316750; Composition: Thick Film; Device Package: 0402 (1005 Metric); Features: Automotive AEC-Q200, Pulse Withstanding; Height - Seated (Max): 0.016" (0.40mm); LastUpdated: 5.10.2023 19:23:22; Lifecycle Status: Active; Minimum Order: 1; Number of Terminations: 2; Operating Temperature: -55°C ~ 155°C; Package / Case: 0402 (1005 Metric); Packaging: TapeAndReel; PartId: 67136; Part Status: Active; Price: 0.01; Ratings: AEC-Q200; Series: SG73P; Size / Dimension: 0.039" L x 0.020" W (1.00mm x 0.50mm); Supplier 1: DigiKey; Supplier Part Number 1: 2019-SG73P1EWTTP2R20FCT-ND; Supplier Device Package: 0402; Tolerance: ±1%
U5 = CMP-0187-00365-3: None; Bandwidth: 1MHz; Number of Elements: 2; Power Supply Rejection Ratio (PSRR): 86dB; Nominal Supply Current: 100uA; Max Supply Voltage: 6V; Input Offset Voltage-Max: 4.5mV; Voltage Gain: 112dB; Input Bias Current: 1pA; Min Supply Voltage: 1.8V; Slew Rate: 0.6V/µs; Operating Supply Voltage: 5.5V; Amplifier Type: GENERAL PURPOSE; Output Current: 23mA; Common Mode Rejection Ratio: 60dB; Gain Bandwidth Product: 1MHz; Min Operating Temperature: -40°C; Supply Current: 100uA; Number of Circuits: 2; Package Quantity: 100; Width: 3.9mm; Technology: CMOS; RoHS Compliant: Yes; Radiation Hardening: No; Mount: Surface Mount; Number of Pins: 8; Length: 4.9mm; Case/Package: SOIC; Number of Channels: 2; Max Operating Temperature: 85°C; Unity Gain Bandwidth Product: 1MHz; Lead Free: Lead Free; Number of Amplifiers: 2; REACH SVHC: No SVHC; Slew Rate-Nom: 0.6V/µs; Height: 1.25mm; Input Offset Voltage (Vos): 4.5mV; Packaging: Rail/Tube

## Sheet MCU.SchDoc
size A4; SheetNumber: 10; SheetTotal: 10
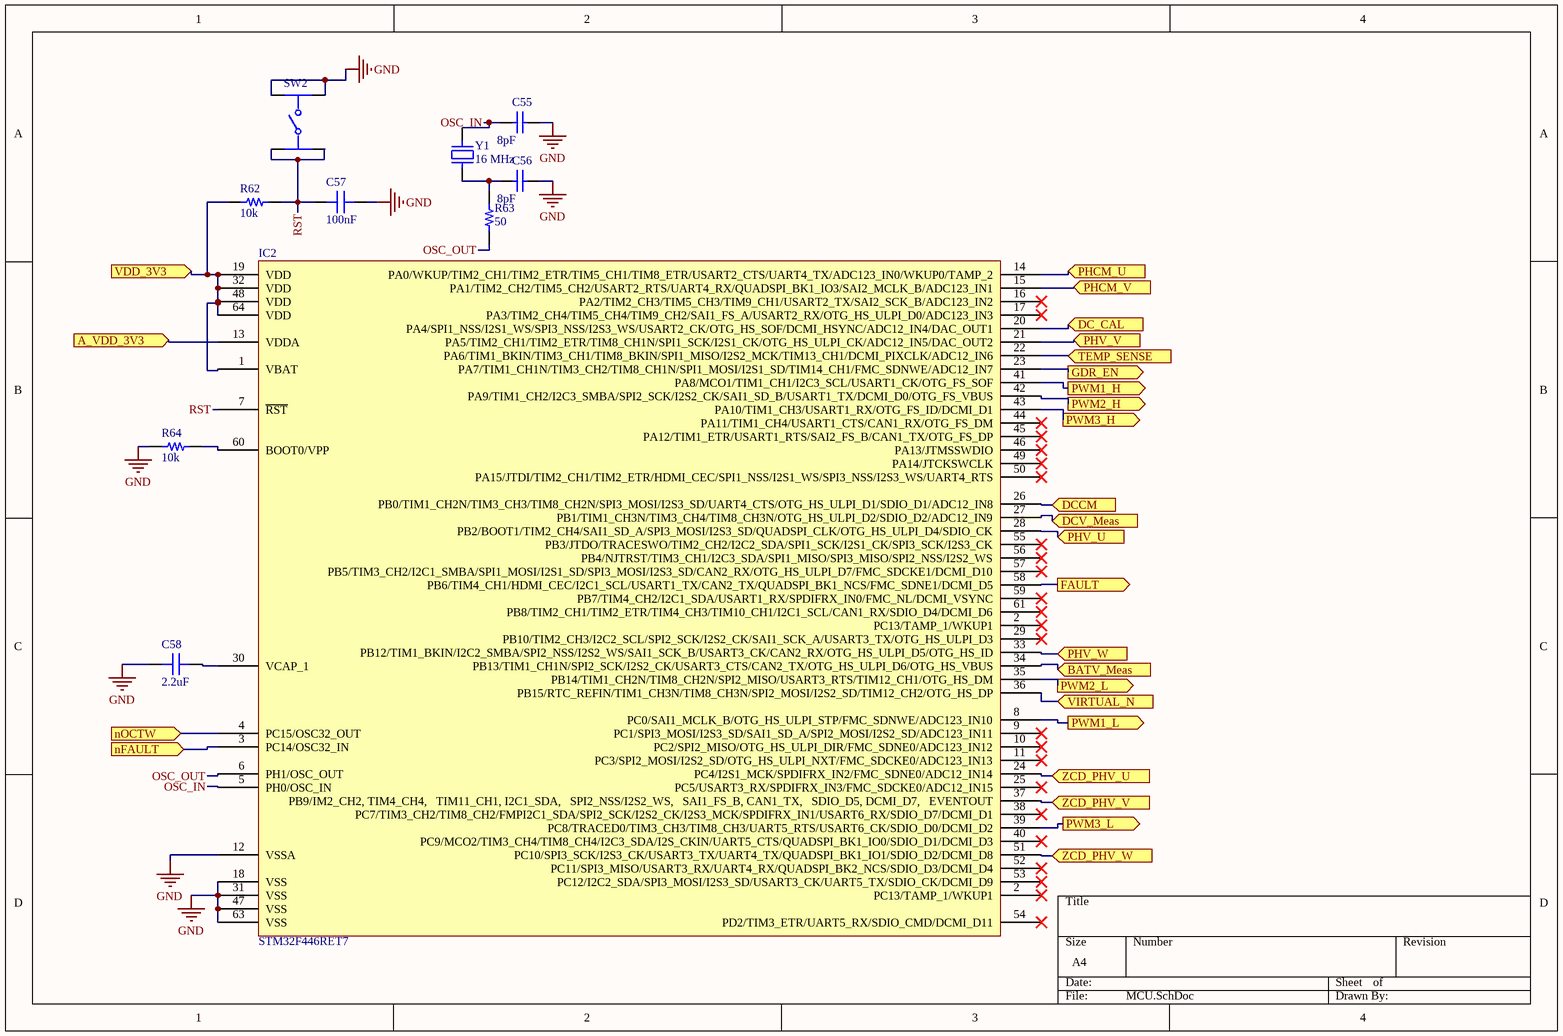
[diagram p9: MCU.SchDoc]

### Parts
C55  value 8pF  [CAPC1005X56X25LL10T15]  (hidden comment: 0402YA240JAT2A)
C56  value 8pF  [CAPC1005X56X25LL10T15]  (hidden comment: 0402YA240JAT2A)
C57  100nF  [CAP 0603_1608]
C58  2.2uF  [CAP 0603_1608]
IC2  STM32F446RET7  [ST LQFP-64 10X10MM]
R62  10k  [RES 0402_1005]
R63  50  [RES 0402_1005]
R64  10k  [RES 0402_1005]
SW2  3-1825910-1  [FP-3-1825910-1-MFG]  (value not drawn)
Y1  16 MHz  [NDK NX5032GA]

### Ports
A_VDD_3V3 (in, see DC-DC_Buck_Converter+12Vto+3.3V[4B]), BATV_Meas (in, see ADC_Input_protection[3C], DC_Current_Voltage_Measurement[2B]), DC_CAL (in, see MotorDrivers[1A]), DCCM (in, see ADC_Input_protection[3B], DC_Current_Voltage_Measurement[3A]), DCV_Meas (in, see ADC_Input_protection[2C], DC_Current_Voltage_Measurement[2B]), FAULT (out, see Power[2D]), GDR_EN (out, see MotorDrivers[1B], Power[2D]), nFAULT (in, see MotorDrivers[1A]), nOCTW (in, see MotorDrivers[2A]), PHCM_U (in, see ADC_Input_protection[2B], MotorDrivers[1C]), PHCM_V (in, see ADC_Input_protection[3B], MotorDrivers[1C]), PHV_U (in, see ADC_Input_protection[2B], PhaseVoltage[1A], ZeroCrossing[2B]), PHV_V (in, see ADC_Input_protection[3B], PhaseVoltage[1A], ZeroCrossing[2B]), PHV_W (in, see ADC_Input_protection[3B], PhaseVoltage[2A], ZeroCrossing[2C]), PWM1_H (out, see MotorDrivers[1B]), PWM1_L (out, see MotorDrivers[1B]), PWM2_H (out, see MotorDrivers[1B]), PWM2_L (out, see MotorDrivers[1B]), PWM3_H (out, see MotorDrivers[1B]), PWM3_L (out, see MotorDrivers[1B]), TEMP_SENSE (in, see DC_Current_Voltage_Measurement[3B]), VDD_3V3 (in, see ADC_Input_protection[3C], DC-DC_Buck_Converter+12Vto+3.3V[3C], DC_Current_Voltage_Measurement[3B], MotorDrivers[1A], MotorDrivers[1B], Power[2C], ZeroCrossing[1A]), VIRTUAL_N (in, see ADC_Input_protection[4B], PhaseVoltage[1A], ZeroCrossing[1B]), ZCD_PHV_U (in, see ZeroCrossing[3B]), ZCD_PHV_V (in, see ZeroCrossing[3B]), ZCD_PHV_W (in, see ZeroCrossing[3C])

### Nets
GND: C55.2 C56.2 C57.1 C58.2 IC2.12(VSSA) IC2.18(VSS) IC2.31(VSS) IC2.36(PB15/RTC_REFIN/TIM1_CH3N/TIM8_CH3N/SPI2_MOSI/I2S2_SD/TIM12_CH2/OTG_HS_DP) IC2.47(VSS) IC2.63(VSS) R64.1 SW2.3 SW2.4 ; port VIRTUAL_N  [project net R_SHUNT1_N]
DC_CAL: IC2.20(PA4/SPI1_NSS/I2S1_WS/SPI3_NSS/I2S3_WS/USART2_CK/OTG_HS_SOF/DCMI_HSYNC/ADC12_IN4/DAC_OUT1) ; port DC_CAL
GDR_EN: IC2.23(PA7/TIM1_CH1N/TIM3_CH2/TIM8_CH1N/SPI1_MOSI/I2S1_SD/TIM14_CH1/FMC_SDNWE/ADC12_IN7) ; port GDR_EN
OSC_IN: C55.1 IC2.5(PH0/OSC_IN) Y1.2
OSC_OUT: IC2.6(PH1/OSC_OUT) R63.1
PWM1_H: IC2.41(PA8/MCO1/TIM1_CH1/I2C3_SCL/USART1_CK/OTG_FS_SOF) ; port PWM1_H
PWM1_L: IC2.8(PC0/SAI1_MCLK_B/OTG_HS_ULPI_STP/FMC_SDNWE/ADC123_IN10) ; port PWM1_L
PWM2_H: IC2.42(PA9/TIM1_CH2/I2C3_SMBA/SPI2_SCK/I2S2_CK/SAI1_SD_B/USART1_TX/DCMI_D0/OTG_FS_VBUS) ; port PWM2_H
PWM2_L: IC2.35(PB14/TIM1_CH2N/TIM8_CH2N/SPI2_MISO/USART3_RTS/TIM12_CH1/OTG_HS_DM) ; port PWM2_L
PWM3_H: IC2.43(PA10/TIM1_CH3/USART1_RX/OTG_FS_ID/DCMI_D1) ; port PWM3_H
PWM3_L: IC2.39(PC8/TRACED0/TIM3_CH3/TIM8_CH3/UART5_RTS/USART6_CK/SDIO_D0/DCMI_D2) ; port PWM3_L
RST: C57.2 IC2.7(~{RST}) R62.1 SW2.1 SW2.2
NetC11_1: IC2.1(VBAT) IC2.19(VDD) IC2.32(VDD) IC2.48(VDD) IC2.64(VDD) R62.2 ; port VDD_3V3
NetC12_1: IC2.13(VDDA) ; port A_VDD_3V3
NetC41_1: IC2.14(PA0/WKUP/TIM2_CH1/TIM2_ETR/TIM5_CH1/TIM8_ETR/USART2_CTS/UART4_TX/ADC123_IN0/WKUP0/TAMP_2) ; port PHCM_U
NetC42_1: IC2.15(PA1/TIM2_CH2/TIM5_CH2/USART2_RTS/UART4_RX/QUADSPI_BK1_IO3/SAI2_MCLK_B/ADC123_IN1) ; port PHCM_V
NetC45_2: IC2.28(PB2/BOOT1/TIM2_CH4/SAI1_SD_A/SPI3_MOSI/I2S3_SD/QUADSPI_CLK/OTG_HS_ULPI_D4/SDIO_CK) ; port PHV_U
NetC47_2: IC2.21(PA5/TIM2_CH1/TIM2_ETR/TIM8_CH1N/SPI1_SCK/I2S1_CK/OTG_HS_ULPI_CK/ADC12_IN5/DAC_OUT2) ; port PHV_V
NetC49_2: IC2.33(PB12/TIM1_BKIN/I2C2_SMBA/SPI2_NSS/I2S2_WS/SAI1_SCK_B/USART3_CK/CAN2_RX/OTG_HS_ULPI_D5/OTG_HS_ID) ; port PHV_W
NetC51_2: IC2.26(PB0/TIM1_CH2N/TIM3_CH3/TIM8_CH2N/SPI3_MOSI/I2S3_SD/UART4_CTS/OTG_HS_ULPI_D1/SDIO_D1/ADC12_IN8) ; port DCCM
NetC53_2: IC2.34(PB13/TIM1_CH1N/SPI2_SCK/I2S2_CK/USART3_CTS/CAN2_TX/OTG_HS_ULPI_D6/OTG_HS_VBUS) ; port BATV_Meas
NetC54_2: IC2.27(PB1/TIM1_CH3N/TIM3_CH4/TIM8_CH3N/OTG_HS_ULPI_D2/SDIO_D2/ADC12_IN9) ; port DCV_Meas
NetC56_1: C56.1 R63.2 Y1.1
NetC58_1: C58.1 IC2.30(VCAP_1)
NetD7_1: IC2.58(PB6/TIM4_CH1/HDMI_CEC/I2C1_SCL/USART1_TX/CAN2_TX/QUADSPI_BK1_NCS/FMC_SDNE1/DCMI_D5) ; port FAULT
NetIC1_5: IC2.4(PC15/OSC32_OUT) ; port nOCTW
NetIC1_6: IC2.3(PC14/OSC32_IN) ; port nFAULT
NetIC2_22: IC2.22(PA6/TIM1_BKIN/TIM3_CH1/TIM8_BKIN/SPI1_MISO/I2S2_MCK/TIM13_CH1/DCMI_PIXCLK/ADC12_IN6) ; port TEMP_SENSE
NetIC2_24: IC2.24(PC4/I2S1_MCK/SPDIFRX_IN2/FMC_SDNE0/ADC12_IN14) ; port ZCD_PHV_U
NetIC2_37: IC2.37(PB9/IM2_CH2,_TIM4_CH4,___TIM11_CH1,_I2C1_SDA,___SPI2_NSS/I2S2_WS,___SAI1_FS_B,_CAN1_TX,___SDIO_D5,_DCMI_D7,___EVENTOUT) ; port ZCD_PHV_V
NetIC2_51: IC2.51(PC10/SPI3_SCK/I2S3_CK/USART3_TX/UART4_TX/QUADSPI_BK1_IO1/SDIO_D2/DCMI_D8) ; port ZCD_PHV_W
NetIC2_60: IC2.60(BOOT0/VPP) R64.2

Not connected (* = marked no-connect by the designer): IC2 2(PC13/TAMP_1/WKUP1)* 9(PC1/SPI3_MOSI/I2S3_SD/SAI1_SD_A/SPI2_MOSI/I2S2_SD/ADC123_IN11)* 10(PC2/SPI2_MISO/OTG_HS_ULPI_DIR/FMC_SDNE0/ADC123_IN12)* 11(PC3/SPI2_MOSI/I2S2_SD/OTG_HS_ULPI_NXT/FMC_SDCKE0/ADC123_IN13)* 16(PA2/TIM2_CH3/TIM5_CH3/TIM9_CH1/USART2_TX/SAI2_SCK_B/ADC123_IN2)* 17(PA3/TIM2_CH4/TIM5_CH4/TIM9_CH2/SAI1_FS_A/USART2_RX/OTG_HS_ULPI_D0/ADC123_IN3)* 25(PC5/USART3_RX/SPDIFRX_IN3/FMC_SDCKE0/ADC12_IN15)* 29(PB10/TIM2_CH3/I2C2_SCL/SPI2_SCK/I2S2_CK/SAI1_SCK_A/USART3_TX/OTG_HS_ULPI_D3)* 38(PC7/TIM3_CH2/TIM8_CH2/FMPI2C1_SDA/SPI2_SCK/I2S2_CK/I2S3_MCK/SPDIFRX_IN1/USART6_RX/SDIO_D7/DCMI_D1)* 40(PC9/MCO2/TIM3_CH4/TIM8_CH4/I2C3_SDA/I2S_CKIN/UART5_CTS/QUADSPI_BK1_IO0/SDIO_D1/DCMI_D3)* 44(PA11/TIM1_CH4/USART1_CTS/CAN1_RX/OTG_FS_DM)* 45(PA12/TIM1_ETR/USART1_RTS/SAI2_FS_B/CAN1_TX/OTG_FS_DP)* 46(PA13/JTMSSWDIO)* 49(PA14/JTCKSWCLK)* 50(PA15/JTDI/TIM2_CH1/TIM2_ETR/HDMI_CEC/SPI1_NSS/I2S1_WS/SPI3_NSS/I2S3_WS/UART4_RTS)* 52(PC11/SPI3_MISO/USART3_RX/UART4_RX/QUADSPI_BK2_NCS/SDIO_D3/DCMI_D4)* 53(PC12/I2C2_SDA/SPI3_MOSI/I2S3_SD/USART3_CK/UART5_TX/SDIO_CK/DCMI_D9)* 54(PD2/TIM3_ETR/UART5_RX/SDIO_CMD/DCMI_D11)* 55(PB3/JTDO/TRACESWO/TIM2_CH2/I2C2_SDA/SPI1_SCK/I2S1_CK/SPI3_SCK/I2S3_CK)* 56(PB4/NJTRST/TIM3_CH1/I2C3_SDA/SPI1_MISO/SPI3_MISO/SPI2_NSS/I2S2_WS)* 57(PB5/TIM3_CH2/I2C1_SMBA/SPI1_MOSI/I2S1_SD/SPI3_MOSI/I2S3_SD/CAN2_RX/OTG_HS_ULPI_D7/FMC_SDCKE1/DCMI_D10)* 59(PB7/TIM4_CH2/I2C1_SDA/USART1_RX/SPDIFRX_IN0/FMC_NL/DCMI_VSYNC)* 61(PB8/TIM2_CH1/TIM2_ETR/TIM4_CH3/TIM10_CH1/I2C1_SCL/CAN1_RX/SDIO_D4/DCMI_D6)*

### Library data of the parts
C55 C56 = CMP-2008-02771-1: Manufacturer: AVX Interconnect / Elco; Part Number: 0402YA240JAT2A
C57 C58 = 0603ZC102KAT2A: as C30 on sheet MotorDrivers; Part Number: 0603ZC102KAT2A; Applications: General Purpose; componentlink1description: Datasheet; componentlink1url: http://datasheets.avx.com/X7RDielectric.pdf; componentlink2description: DigiKey Link; componentlink2url: http://digikey.com/product-detail/en/avx-corporation/0603ZC102KAT2A/478-0603ZC102KAT2ACT-ND/11570315; Device Package: 0603 (1608 Metric); lastupdated: 2.09.2020 01:02:55; Lifecycle Status: Active; Minimum Order: 1; Mounting Type: Surface Mount, MLCC; Operating Temperature: -55°C ~ 125°C; Package / Case: 0603 (1608 Metric); packaging: TapeAndReel; partid: 27370; Part Status: Active; price: 0.01; series: -; Supplier 1: DigiKey; Supplier Part Number 1: 478-0603ZC102KAT2ACT-ND; Temperature Coefficient: X7R; Voltage - Rated: 10V
  C57: Value: 100nF; Capacitance: 100nF
  C58: Value: 2.2uF; Capacitance: 2.2uF
IC2 = STM32F446RET7: IC MCU 32BIT 512KB FLASH 64LQFP; Manufacturer: STMicroelectronics; Connectivity: CANbus, EBI/EMI, I²C, IrDA, LINbus, SAI, SD, SPDIF-Rx, SPI, UART/USART, USB, USB OTG; Core Processor: ARM® Cortex®-M4; Core Size: 32-Bit Single-Core; Data Converters: A/D 16x12b; D/A 2x12b; Number of I/O: 50; Oscillator Type: Internal; Peripherals: Brown-out Detect/Reset, DMA, I²S, LVD, POR, PWM, WDT; Program Memory Size: 512KB (512K x 8); RAM Size: 128K x 8; Speed: 180MHz; Voltage - Supply (Vcc/Vdd): 1.7V ~ 3.6V; Part Number: STM32F446RET7; ComponentLink1Description: Datasheet; ComponentLink1URL: https://www.st.com/content/ccc/resource/technical/document/datasheet/65/cb/75/50/53/d6/48/24/DM00141306.pdf/files/DM00141306.pdf/jcr:content/translations/en.DM00141306.pdf; ComponentLink2Description: DigiKey Link; ComponentLink2URL: https://www.digikey.com/en/products/detail/stmicroelectronics/STM32F446RET7/6207480; LastUpdated: 5.10.2023 20:25:32; Lifecycle Status: Active; Minimum Order: 1; Mounting Type: Surface Mount; Operating Temperature: -40°C ~ 105°C (TA); Packaging: Tray; PartId: 220; Part Status: Active; Price: 6.42; Program Memory Type: FLASH; Series: STM32F4; Supplier 1: DigiKey; Supplier Part Number 1: 497-16775-ND; Supplier Device Package: 64-LQFP (10x10)
R62 R64 = ESR01MZPF47R0: as R28 on sheet MotorDrivers; Part Number: ESR01MZPF47R0; Value: 10k; ComponentLink1Description: Datasheet; ComponentLink1URL: https://fscdn.rohm.com/en/products/databook/datasheet/passive/resistor/chip_resistor/esr-e.pdf; ComponentLink2Description: DigiKey Link; ComponentLink2URL: https://www.digikey.com/en/products/detail/rohm-semiconductor/ESR01MZPF47R0/16180187; Composition: Thick Film; Device Package: 0402 (1005 Metric); Features: Automotive AEC-Q200, Pulse Withstanding; Height - Seated (Max): 0.016" (0.40mm); LastUpdated: 5.10.2023 19:23:22; Lifecycle Status: Active; Minimum Order: 1; Number of Terminations: 2; Operating Temperature: -55°C ~ 155°C; Package / Case: 0402 (1005 Metric); Packaging: TapeAndReel; PartId: 67421; Part Status: Active; Price: 0.03; Ratings: AEC-Q200; Series: ESR; Size / Dimension: 0.039" L x 0.020" W (1.00mm x 0.50mm); Supplier 1: DigiKey; Supplier Part Number 1: 511-ESR01MZPF47R0CT-ND; Supplier Device Package: 0402
R63 = UBR0402B500FZTR\500: 0402, 50 OHM; Manufacturer: AVX Corporation; Power (Watts): 0.125W, 1/8W; Resistance: 50 Ohms; Temperature Coefficient: ±100ppm/°C; Tolerance: ±1%; Part Number: UBR0402B500FZTR\500; Value: 50; ComponentLink1Description: Datasheet; ComponentLink1URL: http://datasheets.avx.com/AVX-UBR-Series.pdf; ComponentLink2Description: DigiKey Link; ComponentLink2URL: http://digikey.com/product-detail/en/avx-corporation/UBR0402B500FZTR-500/478-12030-1-ND/8595063; Composition: Thin Film; Device Package: 0402 (1005 Metric); Height - Seated (Max): 0.024" (0.60mm); LastUpdated: 2.09.2020 01:07:37; Lifecycle Status: Active; Minimum Order: 1; Number of Terminations: 2; Operating Temperature: -40°C ~ 125°C; Package / Case: 0402 (1005 Metric); Packaging: TapeAndReel; PartId: 17454; Part Status: Active; Price: 1.52; Series: UBR; Size / Dimension: 0.039" L x 0.020" W (1.00mm x 0.50mm); Supplier 1: DigiKey; Supplier Part Number 1: 478-12030-1-ND; Supplier Device Package: 0402
SW2 = CMP-03407-000001-1: SWITCH TACTILE SPST-NO 0.05A 24V; Manufacturer: TE Connectivity; Operating Force: 160gf; Contact Current Rating: 50mA; Contact Resistance: 100mΩ; Electromechanical Life: 100000Cycles; Device Class L1: Electromechanical; ComponentLink2URL: https://www.te.com/commerce/DocumentDelivery/DDEController?Action=srchrtrv&DocNm=1825910&DocType=Customer+Drawing&DocLang=English; Category: Switch; Device Class L2: Switches; Temperature: -35°C to +85°C; RoHS: TRUE; Mount: Through Hole; Manufacturer Part Number: 3-1825910-1; Automotive: No; Lead Free: Yes; Device Class L3: Tactile Switches; ComponentLink2Description: Datasheet; Temperature Range High: +85°C; Height: 17.3mm; Package: 0; Temperature Range Low: -35°C; Throw Configuration: SPST-NO; Digikey Description: SWITCH TACTILE SPST-NO 0.05A 24V; Octopart: https://octopart.com/3-1825910-1-te+connectivity-46506874
Y1 = NX5032GA-16MHZ-STD-CSK-4: CRYSTAL 16.0000MHZ 8PF SMD; Manufacturer: NDK America, Inc.; ESR (Equivalent Series Resistance): 50 Ohms; Frequency Stability: ±30ppm; Frequency Tolerance: ±20ppm; Operating Mode: Fundamental; Part Number: NX5032GA-16MHZ-STD-CSK-4; ComponentLink1Description: Datasheet; ComponentLink1URL: http://www.ndk.com/images/products/catalog/c_NX5032GA_e.pdf; ComponentLink2Description: DigiKey Link; ComponentLink2URL: https://www.digikey.com/en/products/detail/ndk-america-inc/NX5032GA-16MHZ-STD-CSK-4/3125646; Frequency: 16 MHz; Height - Seated (Max): 0.059" (1.50mm); LastUpdated: 6.10.2023 20:27:39; Lifecycle Status: Active; Load Capacitance: 8pF; Minimum Order: 1; Mounting Type: Surface Mount; Operating Temperature: -10°C ~ 70°C; Package / Case: 2-SMD, No Lead; Packaging: TapeAndReel; PartId: 630; Part Status: Active; Price: 0.34; Series: NX5032GA; Size / Dimension: 0.197" L x 0.126" W (5.00mm x 3.20mm); Supplier 1: DigiKey; Supplier Part Number 1: 644-1187-1-ND; Type: MHz Crystal; Value: 16 MHz

## Nets that join several sheets
+12: Main (J1.2), Power (D1.2 F1.1)
R_SHUNT1_N: Main (J1.1), Power (21 pins), PhaseVoltage (8 pins), Motors (8 pins), DC-DC_Buck_Converter+12Vto+3.3V (21 pins), ADC_Input_protection (D13.1), MotorDrivers (18 pins), ZeroCrossing (15 pins), DC_Current_Voltage_Measurement (11 pins), MCU (13 pins)
DC_CAL: MotorDrivers (IC1.12), MCU (IC2.20)
GDR_EN: Power (D8.1), MotorDrivers (IC1.16), MCU (IC2.23)
GH_A: Motors (R17.2), MotorDrivers (IC1.47)
GH_B: Motors (R18.2), MotorDrivers (IC1.42)
GH_C: Motors (R19.2), MotorDrivers (IC1.37)
GL_A: Motors (R23.2), MotorDrivers (IC1.45)
GL_B: Motors (R24.2), MotorDrivers (IC1.40)
GL_C: Motors (R25.2), MotorDrivers (IC1.35)
MOTOR_U: Main (J2.1), PhaseVoltage (R39.2), Motors (9 pins), MotorDrivers (C32.1 IC1.46)
MOTOR_V: Main (J2.2), PhaseVoltage (R41.2), Motors (9 pins), MotorDrivers (C34.1 IC1.41)
MOTOR_W: Main (J2.3), PhaseVoltage (R43.2), Motors (9 pins), MotorDrivers (C36.1 IC1.36)
NetC1_1: Power (C1.1 F1.2 L1.1 R1.2), DC_Current_Voltage_Measurement (R58.2)
NetC2_1: Power (6 pins), Motors (15 pins), DC-DC_Buck_Converter+12Vto+3.3V (D9.2), MotorDrivers (C39.2 C40.2 IC1.29), DC_Current_Voltage_Measurement (R59.2)
NetC11_1: Power (D6.1), DC-DC_Buck_Converter+12Vto+3.3V (12 pins), ADC_Input_protection (5 pins), MotorDrivers (5 pins), ZeroCrossing (6 pins), DC_Current_Voltage_Measurement (C52.2 R57.2 U5.4), MCU (6 pins)
NetC12_1: DC-DC_Buck_Converter+12Vto+3.3V (C12.1 FB1.2), MCU (IC2.13)
NetC41_1: ADC_Input_protection (D14.2), MotorDrivers (C41.1 R36.1), MCU (IC2.14)
NetC42_1: ADC_Input_protection (D14.1), MotorDrivers (C42.1 R37.1), MCU (IC2.15)
NetC45_2: PhaseVoltage (R38.2 R39.1 R44.2), ADC_Input_protection (D12.2), ZeroCrossing (C45.2 U2.1), MCU (IC2.28)
NetC47_2: PhaseVoltage (R40.2 R41.1 R45.2), ADC_Input_protection (D12.1), ZeroCrossing (C47.2 U3.1), MCU (IC2.21)
NetC49_2: PhaseVoltage (R42.2 R43.1 R46.2), ADC_Input_protection (D13.2), ZeroCrossing (C49.2 U4.1), MCU (IC2.33)
NetC51_2: ADC_Input_protection (D15.2), DC_Current_Voltage_Measurement (C51.2 R53.2), MCU (IC2.26)
NetC53_2: ADC_Input_protection (D16.1), DC_Current_Voltage_Measurement (C53.2 R58.1 R60.2), MCU (IC2.34)
NetC54_2: ADC_Input_protection (D16.2), DC_Current_Voltage_Measurement (C54.2 R59.1 R61.2), MCU (IC2.27)
NetD7_1: Power (D7.1), MCU (IC2.58)
NetIC1_5: MotorDrivers (IC1.5 R29.2), MCU (IC2.4)
NetIC1_6: MotorDrivers (IC1.6 R28.2), MCU (IC2.3)
NetIC2_22: DC_Current_Voltage_Measurement (Q9.1 Q9.3 R57.1), MCU (IC2.22)
NetIC2_24: ZeroCrossing (R47.2 U2.4), MCU (IC2.24)
NetIC2_37: ZeroCrossing (R48.2 U3.4), MCU (IC2.37)
NetIC2_51: ZeroCrossing (R49.2 U4.4), MCU (IC2.51)
PWM1_H: MotorDrivers (IC1.17), MCU (IC2.41)
PWM1_L: MotorDrivers (IC1.18), MCU (IC2.8)
PWM2_H: MotorDrivers (IC1.19), MCU (IC2.42)
PWM2_L: MotorDrivers (IC1.20), MCU (IC2.35)
PWM3_H: MotorDrivers (IC1.21), MCU (IC2.43)
PWM3_L: MotorDrivers (IC1.22), MCU (IC2.39)
R_SHUNT1_P: Motors (6 pins), MotorDrivers (IC1.33 IC1.44)
R_SHUNT2_P: Motors (6 pins), MotorDrivers (IC1.31 IC1.39)